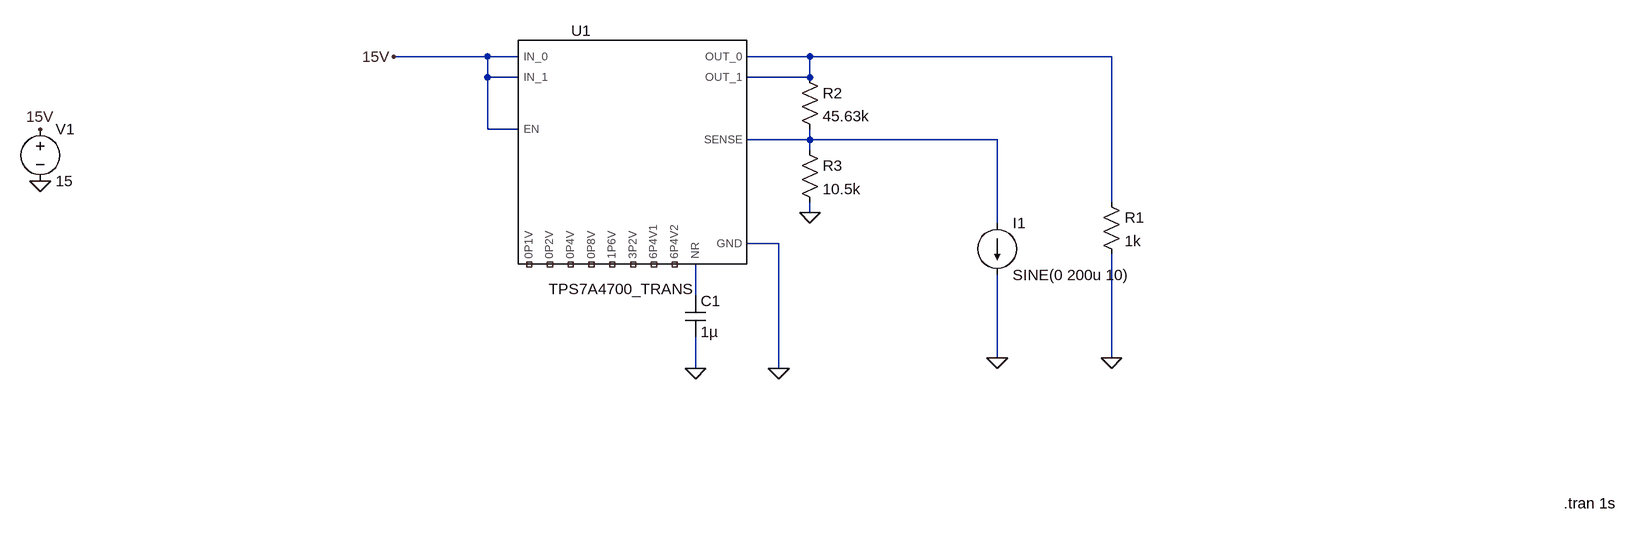
[diagram p0: schematic Draft2.asc]
Draft2.asc, the LTspice schematic file:
Version 4.1
SHEET 1 880 680
WIRE -1600 -512 -1744 -512
WIRE -1552 -512 -1600 -512
WIRE -1104 -512 -1200 -512
WIRE -640 -512 -1104 -512
WIRE -1600 -480 -1600 -512
WIRE -1552 -480 -1600 -480
WIRE -1104 -480 -1104 -512
WIRE -1104 -480 -1200 -480
WIRE -1600 -400 -1600 -480
WIRE -1552 -400 -1600 -400
WIRE -1104 -384 -1104 -400
WIRE -1104 -384 -1200 -384
WIRE -816 -384 -1104 -384
WIRE -1104 -368 -1104 -384
WIRE -640 -288 -640 -512
WIRE -1104 -272 -1104 -288
WIRE -816 -256 -816 -384
WIRE -1152 -224 -1200 -224
WIRE -1280 -144 -1280 -192
WIRE -816 -48 -816 -176
WIRE -640 -48 -640 -208
WIRE -1280 -32 -1280 -80
WIRE -1152 -32 -1152 -224
FLAG -2288 -320 0
FLAG -2288 -400 15V
FLAG -1744 -512 15V
FLAG -1280 -32 0
FLAG -1152 -32 0
FLAG -640 -48 0
FLAG -1104 -272 0
FLAG -816 -48 0
SYMBOL outputControl\\TPS7A4700_TRANS -1456 -400 R0
SYMATTR InstName U1
SYMBOL voltage -2288 -416 R0
WINDOW 123 0 0 Left 0
WINDOW 39 0 0 Left 0
SYMATTR InstName V1
SYMATTR Value 15
SYMBOL cap -1296 -144 R0
SYMATTR InstName C1
SYMATTR Value 1µ
SYMBOL res -656 -304 R0
SYMATTR InstName R1
SYMATTR Value 1k
SYMBOL res -1120 -496 R0
SYMATTR InstName R2
SYMATTR Value 45.63k
SYMBOL res -1120 -384 R0
SYMATTR InstName R3
SYMATTR Value 10.5k
SYMBOL current -816 -256 R0
WINDOW 123 0 0 Left 0
WINDOW 39 0 0 Left 0
SYMATTR InstName I1
SYMATTR Value SINE(0 200u 10)
TEXT 56 176 Left 2 !.tran 1s

The netlist it stands for:
* Draft2.asc
X§U1 NC_01 NC_02 NC_03 NC_04 NC_05 NC_06 NC_07 NC_08 15V 0 N003 N002 15V 15V N001 N001 TPS7A4700_TRANS  ; pins 0P1V 0P2V 0P4V 0P8V 1P6V 3P2V 6P4V1 6P4V2 EN GND NR SENSE IN_0 IN_1 OUT_0 OUT_1
V1 15V 0 15
C1 N003 0 1µ
R1 N001 0 1k
R2 N001 N002 45.63k
R3 N002 0 10.5k
I1 N002 0 SINE(0 200u 10)
.tran 1s
.lib tps7a4700_trans.lib
.backanno
.end